# EAGLE schematic Layer 1 (EAGLE 9.6.2)

## Sheet 1 of 5
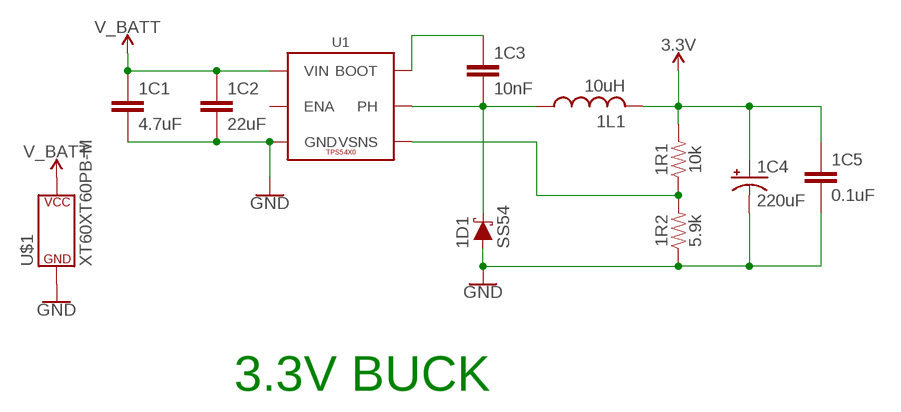
[diagram p0: schematic, sheet 1]

### Parts
1C1  4.7uF  CAPACITOR0603  [C0603]
1C2  22uF  CAPACITOR1210  [C1210]
1C3  10nF  CAPACITOR0603  [C0603]
1C4  220uF  100UF-POLAR-EIA7343-10V-10%(TANT)  [EIA7343]
1C5  0.1uF  CAPACITOR0603  [C0603]
1D1  SS54  DIODE-SCHOTTKY  [SMA-DIODE]
1L1  10uH  INDUCTORSWPA8040  [SWPA8040]
1R1  10k  RESISTOR0603  [R0603]
1R2  5.9k  RESISTOR0603  [R0603]
U1  TPS54X0  [POWERPAD-SOIC-8]
U$1  XT60XT60PB-M  [XT60PB-M]

### Nets
3.3V: 1C4.A(+) 1C5.1 1L1.P2 1R1.2 ; also sheet 2,3,4
GND: 1C1.2 1C2.2 1C4.C(-) 1C5.2 1D1.A 1R2.1 U1.6(GND) U1.9(GND) U1.P$1(GND) U1.P$2(GND) U1.P$3(GND) U1.P$4(GND) U1.P$5(GND) U1.P$6(GND) U$1.-(P$V-) ; also sheet 2,3,4,5
N$1: 1C3.1 U1.1(BOOT)
N$2: 1C3.2 1D1.C 1L1.P1 U1.8(PH)
N$4: 1R1.1 1R2.2 U1.4(VSNS)
V_BATT: 1C1.1 1C2.1 U1.7(VIN) U$1.+(P$V+) ; also sheet 3,4,5
Unconnected: U1.2(NC) U1.3(NC) U1.5(ENA)

### Notes on the sheet
- 3.3V BUCK

## Sheet 2 of 5
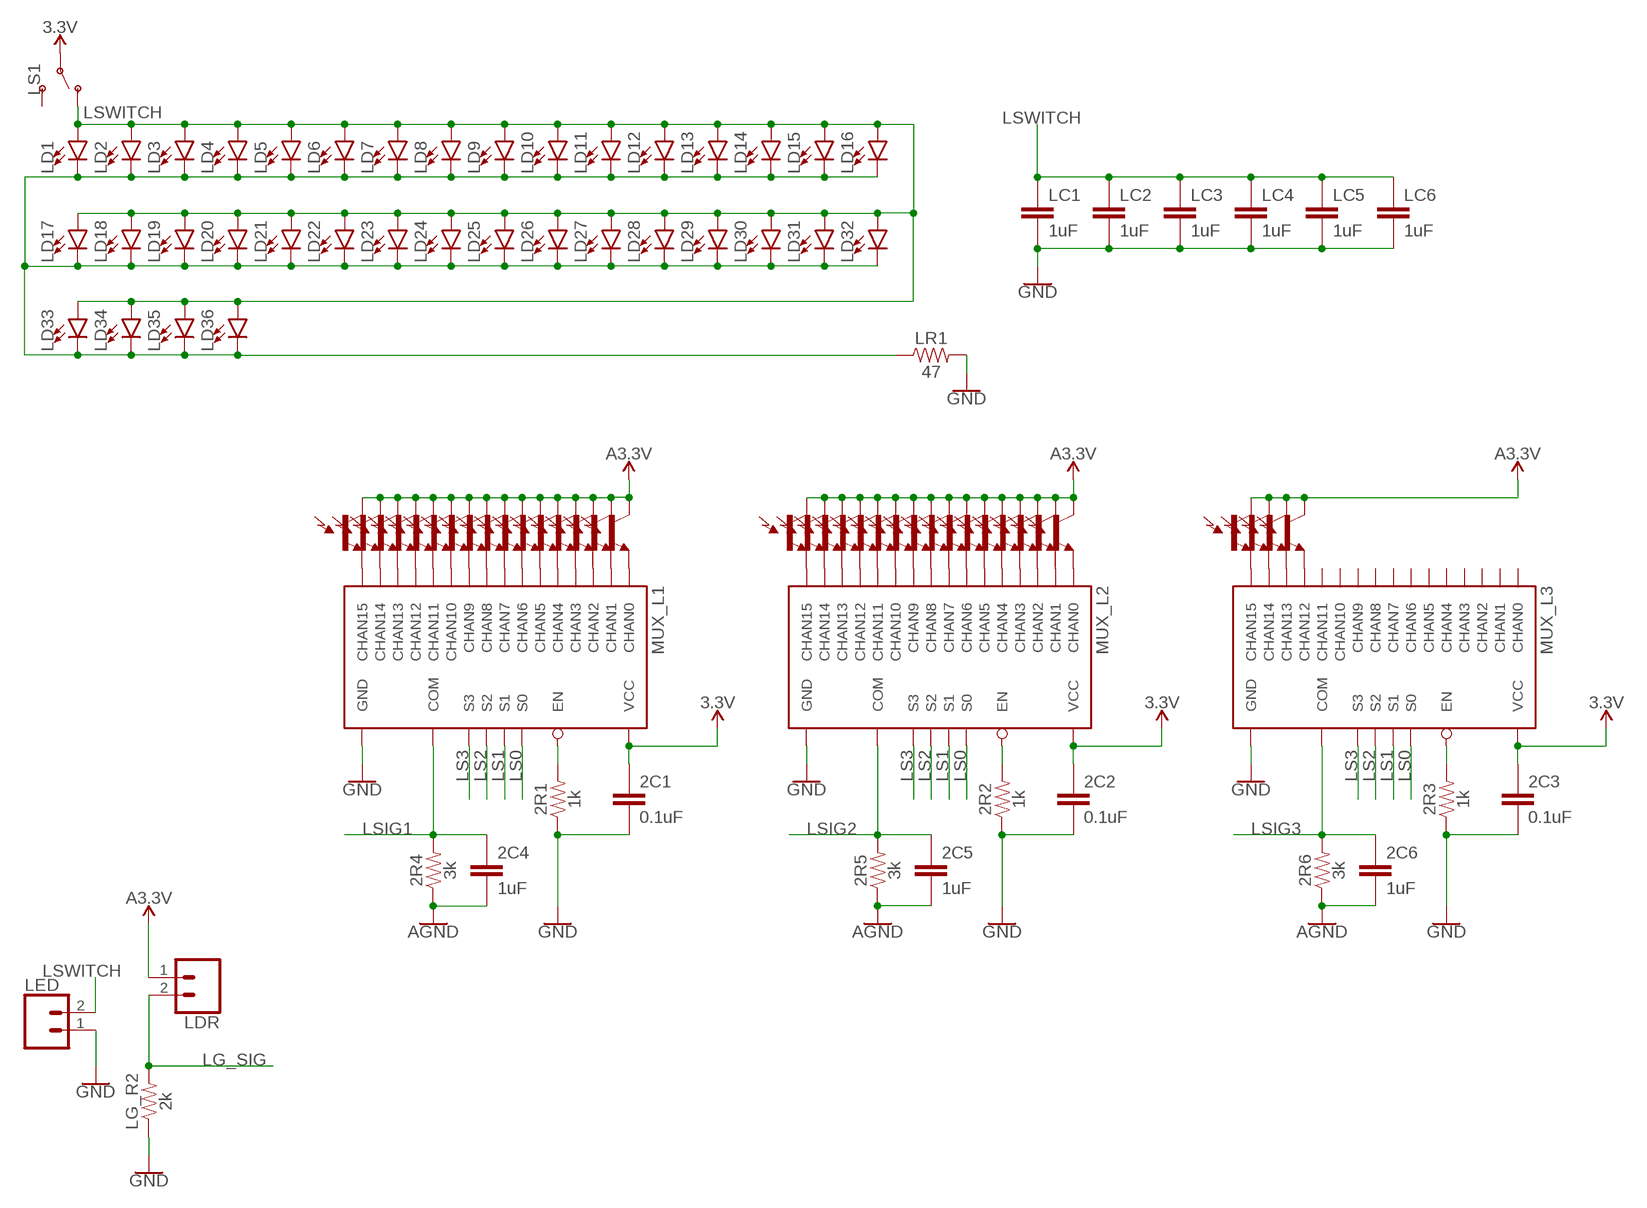
[diagram p1: schematic, sheet 2]

### Parts
2C1  0.1uF  CAPACITOR0603  [C0603]
2C2  0.1uF  CAPACITOR0603  [C0603]
2C3  0.1uF  CAPACITOR0603  [C0603]
2C4  1uF  CAPACITOR0603  [C0603]
2C5  1uF  CAPACITOR0603  [C0603]
2C6  1uF  CAPACITOR0603  [C0603]
2R1  1k  RESISTOR0603  [R0603]
2R2  1k  RESISTOR0603  [R0603]
2R3  1k  RESISTOR0603  [R0603]
2R4  3k  RESISTOR0603  [R0603]
2R5  3k  RESISTOR0603  [R0603]
2R6  3k  RESISTOR0603  [R0603]
LC1  1uF  CAPACITOR0603  [C0603]
LC2  1uF  CAPACITOR0603  [C0603]
LC3  1uF  CAPACITOR0603  [C0603]
LC4  1uF  CAPACITOR0603  [C0603]
LC5  1uF  CAPACITOR0603  [C0603]
LC6  1uF  CAPACITOR0603  [C0603]
LD1  3528LED  [3528]
LD2  3528LED  [3528]
LD3  3528LED  [3528]
LD4  3528LED  [3528]
LD5  3528LED  [3528]
LD6  3528LED  [3528]
LD7  3528LED  [3528]
LD8  3528LED  [3528]
LD9  3528LED  [3528]
LD10  3528LED  [3528]
LD11  3528LED  [3528]
LD12  3528LED  [3528]
LD13  3528LED  [3528]
LD14  3528LED  [3528]
LD15  3528LED  [3528]
LD16  3528LED  [3528]
LD17  3528LED  [3528]
LD18  3528LED  [3528]
LD19  3528LED  [3528]
LD20  3528LED  [3528]
LD21  3528LED  [3528]
LD22  3528LED  [3528]
LD23  3528LED  [3528]
LD24  3528LED  [3528]
LD25  3528LED  [3528]
LD26  3528LED  [3528]
LD27  3528LED  [3528]
LD28  3528LED  [3528]
LD29  3528LED  [3528]
LD30  3528LED  [3528]
LD31  3528LED  [3528]
LD32  3528LED  [3528]
LD33  3528LED  [3528]
LD34  3528LED  [3528]
LD35  3528LED  [3528]
LD36  3528LED  [3528]
LDR  CONN_021X02_NO_SILK  [1X02_NO_SILK]
LED  CONN_02POLAR  [MOLEX-1X2]
LG_R2  2k  RESISTOR0603  [R0603]
LR1  47  RESISTOR0603  [R0603]
LS1  SWITCH-SPDT-PTH-11.6X4.0MM-LOCK  [SWITCH_SPDT_PTH_11.6X4.0MM_LOCK]
MUX_L1  74HC4067SSOP-24  [SSOP24]
MUX_L2  74HC4067SSOP-24  [SSOP24]
MUX_L3  74HC4067SSOP-24  [SSOP24]
Q1  LIGHT_SENSORALS  [ALS-PT19]
Q2  LIGHT_SENSORALS  [ALS-PT19]
Q3  LIGHT_SENSORALS  [ALS-PT19]
Q4  LIGHT_SENSORALS  [ALS-PT19]
Q5  LIGHT_SENSORALS  [ALS-PT19]
Q6  LIGHT_SENSORALS  [ALS-PT19]
Q7  LIGHT_SENSORALS  [ALS-PT19]
Q8  LIGHT_SENSORALS  [ALS-PT19]
Q9  LIGHT_SENSORALS  [ALS-PT19]
Q10  LIGHT_SENSORALS  [ALS-PT19]
Q11  LIGHT_SENSORALS  [ALS-PT19]
Q12  LIGHT_SENSORALS  [ALS-PT19]
Q13  LIGHT_SENSORALS  [ALS-PT19]
Q14  LIGHT_SENSORALS  [ALS-PT19]
Q15  LIGHT_SENSORALS  [ALS-PT19]
Q16  LIGHT_SENSORALS  [ALS-PT19]
Q17  LIGHT_SENSORALS  [ALS-PT19]
Q18  LIGHT_SENSORALS  [ALS-PT19]
Q19  LIGHT_SENSORALS  [ALS-PT19]
Q20  LIGHT_SENSORALS  [ALS-PT19]
Q21  LIGHT_SENSORALS  [ALS-PT19]
Q22  LIGHT_SENSORALS  [ALS-PT19]
Q23  LIGHT_SENSORALS  [ALS-PT19]
Q24  LIGHT_SENSORALS  [ALS-PT19]
Q25  LIGHT_SENSORALS  [ALS-PT19]
Q26  LIGHT_SENSORALS  [ALS-PT19]
Q27  LIGHT_SENSORALS  [ALS-PT19]
Q28  LIGHT_SENSORALS  [ALS-PT19]
Q29  LIGHT_SENSORALS  [ALS-PT19]
Q30  LIGHT_SENSORALS  [ALS-PT19]
Q31  LIGHT_SENSORALS  [ALS-PT19]
Q32  LIGHT_SENSORALS  [ALS-PT19]
Q33  LIGHT_SENSORALS  [ALS-PT19]
Q34  LIGHT_SENSORALS  [ALS-PT19]
Q35  LIGHT_SENSORALS  [ALS-PT19]
Q36  LIGHT_SENSORALS  [ALS-PT19]

### Nets
3.3V: 2C1.1 2C2.1 2C3.1 LS1.2(P) MUX_L1.24(VCC) MUX_L2.24(VCC) MUX_L3.24(VCC) ; also sheet 1,3,4
AGND: 2C4.2 2C5.2 2C6.2 2R4.1 2R5.1 2R6.1 ; also sheet 4
GND: 2C1.2 2C2.2 2C3.2 2R1.1 2R2.1 2R3.1 LC1.2 LC2.2 LC3.2 LC4.2 LC5.2 LC6.2 LED.1 LG_R2.1 LR1.2 MUX_L1.12(GND) MUX_L2.12(GND) MUX_L3.12(GND) ; also sheet 1,3,4,5
LG_SIG: LDR.2 LG_R2.2 ; also sheet 4
LS0: MUX_L1.10(S0) MUX_L2.10(S0) MUX_L3.10(S0) ; also sheet 4
LS1: MUX_L1.11(S1) MUX_L2.11(S1) MUX_L3.11(S1) ; also sheet 4
LS2: MUX_L1.14(S2) MUX_L2.14(S2) MUX_L3.14(S2) ; also sheet 4
LS3: MUX_L1.13(S3) MUX_L2.13(S3) MUX_L3.13(S3) ; also sheet 4
LSIG1: 2C4.1 2R4.2 MUX_L1.1(COM) ; also sheet 4
LSIG2: 2C5.1 2R5.2 MUX_L2.1(COM) ; also sheet 4
LSIG3: 2C6.1 2R6.2 MUX_L3.1(COM) ; also sheet 4
LSWITCH: LC1.1 LC2.1 LC3.1 LC4.1 LC5.1 LC6.1 LD1.A LD2.A LD3.A LD4.A LD5.A LD6.A LD7.A LD8.A LD9.A LD10.A LD11.A LD12.A LD13.A LD14.A LD15.A LD16.A LD17.A LD18.A LD19.A LD20.A LD21.A LD22.A LD23.A LD24.A LD25.A LD26.A LD27.A LD28.A LD29.A LD30.A LD31.A LD32.A LD33.A LD34.A LD35.A LD36.A LED.2 LS1.1(O)
N$52: 2R1.2 MUX_L1.15(EN)
N$53: MUX_L1.16(CHAN15) Q1.E(E1)
N$54: MUX_L1.17(CHAN14) Q2.E(E1)
N$55: MUX_L1.18(CHAN13) Q3.E(E1)
N$56: MUX_L1.19(CHAN12) Q4.E(E1)
N$57: MUX_L1.20(CHAN11) Q5.E(E1)
N$58: MUX_L1.21(CHAN10) Q6.E(E1)
N$59: MUX_L1.22(CHAN9) Q7.E(E1)
N$60: MUX_L1.23(CHAN8) Q8.E(E1)
N$61: MUX_L1.2(CHAN7) Q9.E(E1)
N$62: MUX_L1.3(CHAN6) Q10.E(E1)
N$63: MUX_L1.4(CHAN5) Q11.E(E1)
N$64: MUX_L1.5(CHAN4) Q12.E(E1)
N$65: MUX_L1.6(CHAN3) Q13.E(E1)
N$66: MUX_L1.7(CHAN2) Q14.E(E1)
N$67: MUX_L1.8(CHAN1) Q15.E(E1)
N$68: MUX_L1.9(CHAN0) Q16.E(E1)
N$69: LD1.C LD2.C LD3.C LD4.C LD5.C LD6.C LD7.C LD8.C LD9.C LD10.C LD11.C LD12.C LD13.C LD14.C LD15.C LD16.C LD17.C LD18.C LD19.C LD20.C LD21.C LD22.C LD23.C LD24.C LD25.C LD26.C LD27.C LD28.C LD29.C LD30.C LD31.C LD32.C LD33.C LD34.C LD35.C LD36.C LR1.1
N$82: 2R2.2 MUX_L2.15(EN)
N$83: MUX_L2.16(CHAN15) Q17.E(E1)
N$84: MUX_L2.17(CHAN14) Q18.E(E1)
N$85: MUX_L2.18(CHAN13) Q19.E(E1)
N$86: MUX_L2.19(CHAN12) Q20.E(E1)
N$87: MUX_L2.20(CHAN11) Q21.E(E1)
N$88: MUX_L2.21(CHAN10) Q22.E(E1)
N$89: MUX_L2.22(CHAN9) Q23.E(E1)
N$90: MUX_L2.23(CHAN8) Q24.E(E1)
N$91: MUX_L2.2(CHAN7) Q25.E(E1)
N$92: MUX_L2.3(CHAN6) Q26.E(E1)
N$93: MUX_L2.4(CHAN5) Q27.E(E1)
N$94: MUX_L2.5(CHAN4) Q28.E(E1)
N$95: MUX_L2.6(CHAN3) Q29.E(E1)
N$96: MUX_L2.7(CHAN2) Q30.E(E1)
N$97: MUX_L2.8(CHAN1) Q31.E(E1)
N$98: MUX_L2.9(CHAN0) Q32.E(E1)
N$99: 2R3.2 MUX_L3.15(EN)
N$100: MUX_L3.16(CHAN15) Q33.E(E1)
N$101: MUX_L3.17(CHAN14) Q34.E(E1)
N$102: MUX_L3.18(CHAN13) Q35.E(E1)
N$103: MUX_L3.19(CHAN12) Q36.E(E1)
VCCA: LDR.1 Q1.C(C1) Q2.C(C1) Q3.C(C1) Q4.C(C1) Q5.C(C1) Q6.C(C1) Q7.C(C1) Q8.C(C1) Q9.C(C1) Q10.C(C1) Q11.C(C1) Q12.C(C1) Q13.C(C1) Q14.C(C1) Q15.C(C1) Q16.C(C1) Q17.C(C1) Q18.C(C1) Q19.C(C1) Q20.C(C1) Q21.C(C1) Q22.C(C1) Q23.C(C1) Q24.C(C1) Q25.C(C1) Q26.C(C1) Q27.C(C1) Q28.C(C1) Q29.C(C1) Q30.C(C1) Q31.C(C1) Q32.C(C1) Q33.C(C1) Q34.C(C1) Q35.C(C1) Q36.C(C1) ; supply symbol labelled A3.3V ; also sheet 4
Unconnected: LS1.3(S) MUX_L3.2(CHAN7) MUX_L3.3(CHAN6) MUX_L3.4(CHAN5) MUX_L3.5(CHAN4) MUX_L3.6(CHAN3) MUX_L3.7(CHAN2) MUX_L3.8(CHAN1) MUX_L3.9(CHAN0) MUX_L3.20(CHAN11) MUX_L3.21(CHAN10) MUX_L3.22(CHAN9) MUX_L3.23(CHAN8)

## Sheet 3 of 5
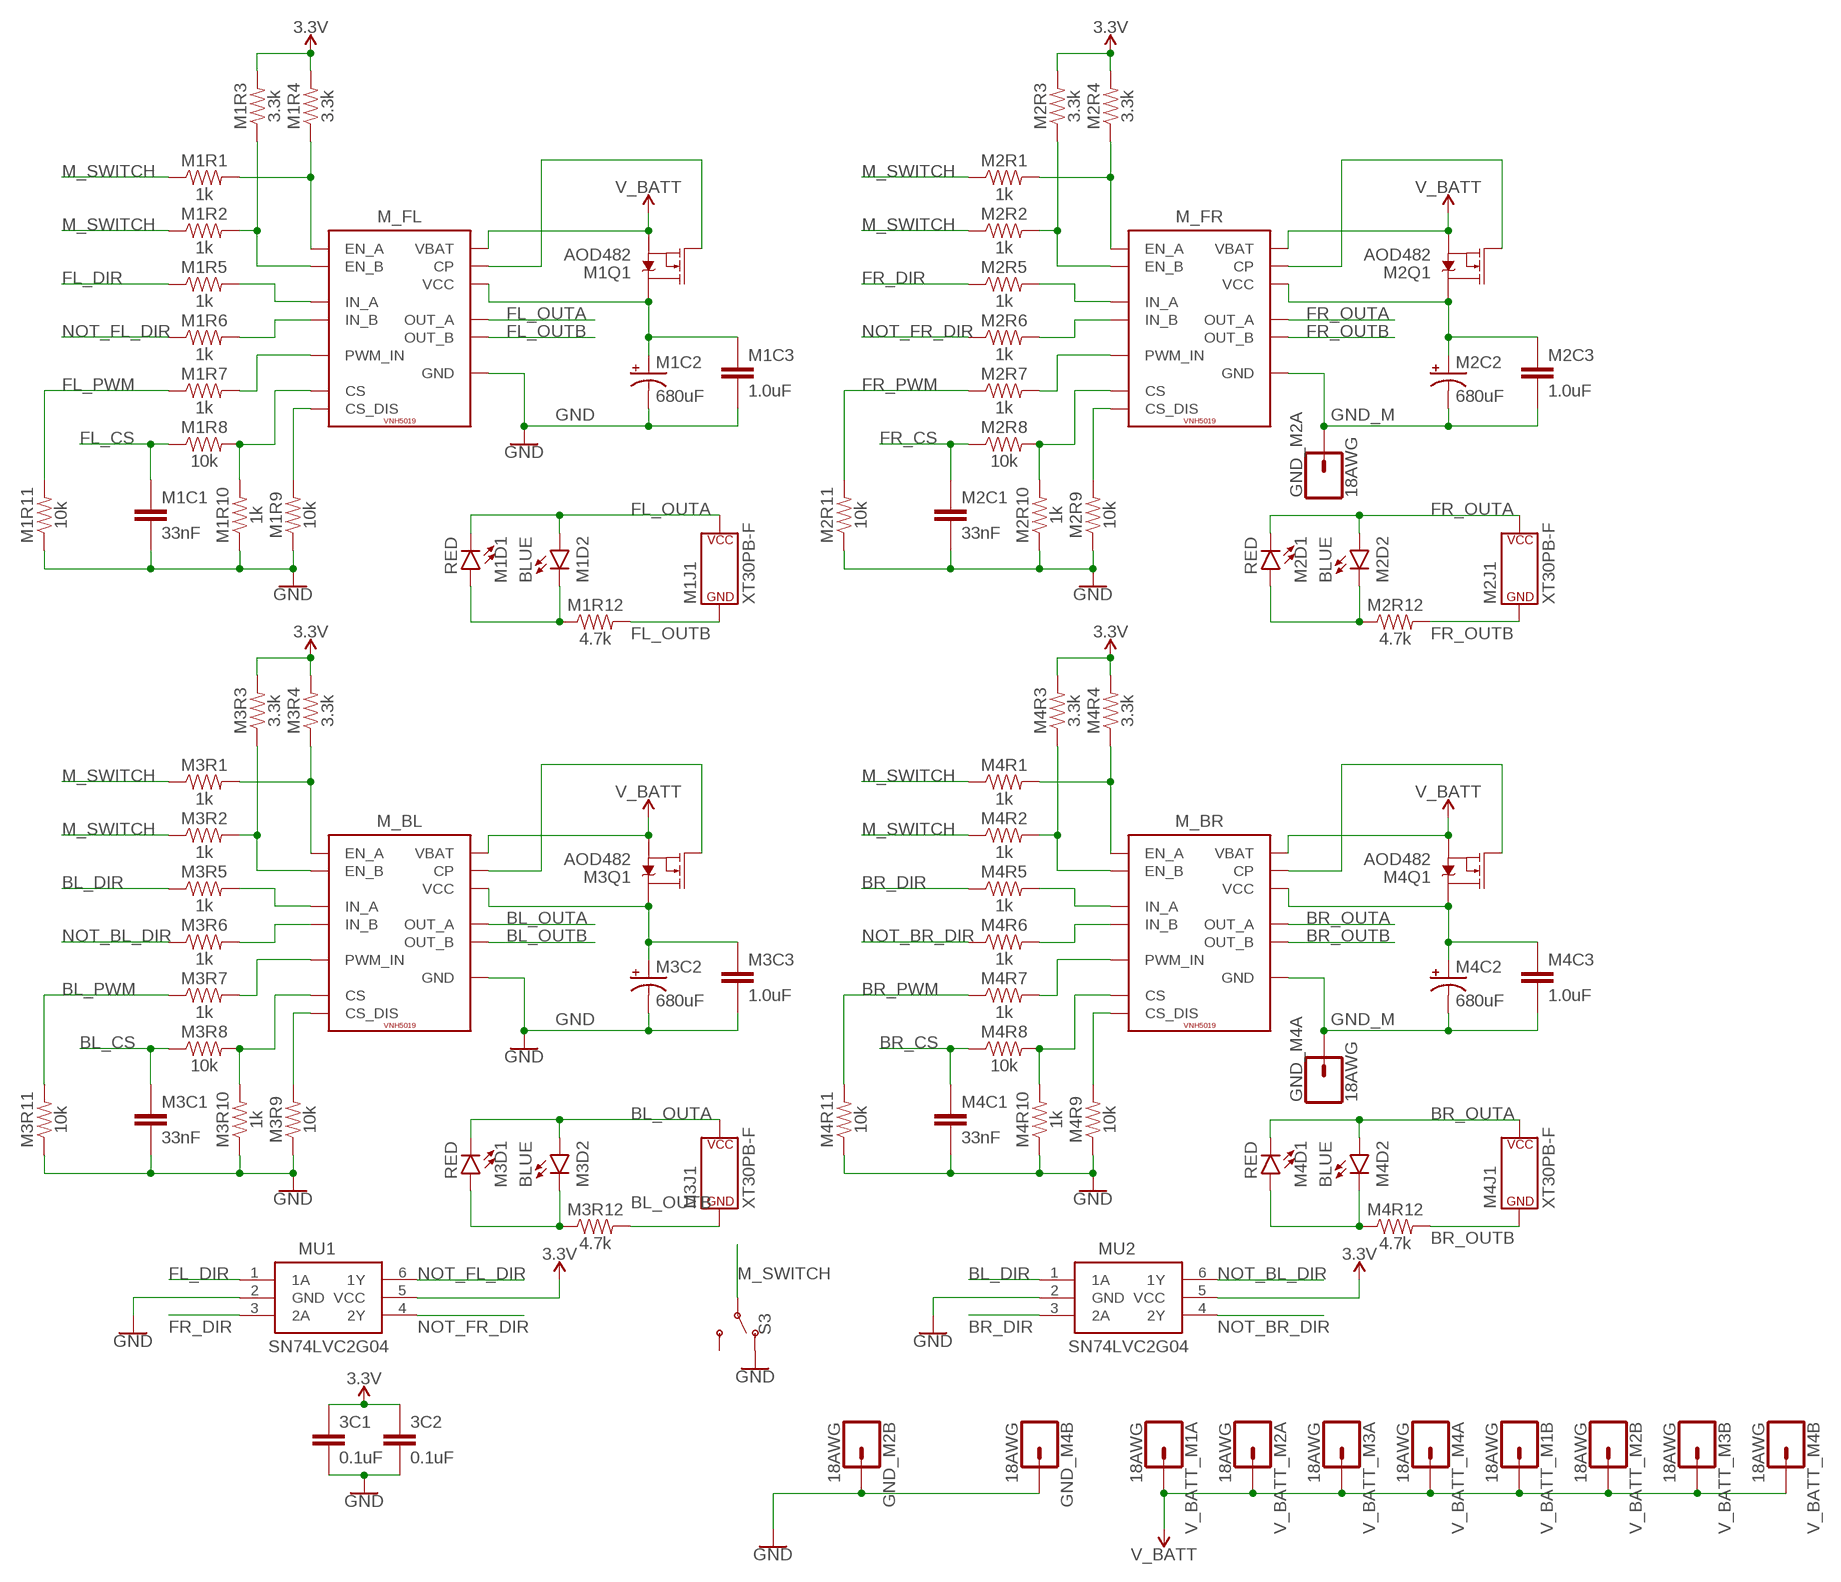
[diagram p2: schematic, sheet 3]

### Parts
3C1  0.1uF  CAPACITOR0603  [C0603]
3C2  0.1uF  CAPACITOR0603  [C0603]
GND_M2A  18AWG  [18AWG]
GND_M2B  18AWG  [18AWG]
GND_M4A  18AWG  [18AWG]
GND_M4B  18AWG  [18AWG]
M1C1  33nF  CAPACITOR0603  [C0603]
M1C2  680uF  3.5MM_CAP  [3.5MM_CAP]
M1C3  1.0uF  CAPACITOR0603  [C0603]
M1D1  RED  LED-RED0603  [LED-0603]
M1D2  BLUE  LED-BLUE0603  [LED-0603]
M1J1  XT30PB-F  [XT30PB-F]
M1Q1  AOD482  MOSFET-NCH-FDD8780  [DPAK]
M1R1  1k  RESISTOR0603  [R0603]
M1R2  1k  RESISTOR0603  [R0603]
M1R3  3.3k  RESISTOR0603  [R0603]
M1R4  3.3k  RESISTOR0603  [R0603]
M1R5  1k  RESISTOR0603  [R0603]
M1R6  1k  RESISTOR0603  [R0603]
M1R7  1k  RESISTOR0603  [R0603]
M1R8  10k  RESISTOR0603  [R0603]
M1R9  10k  RESISTOR0603  [R0603]
M1R10  1k  RESISTOR0603  [R0603]
M1R11  10k  RESISTOR0603  [R0603]
M1R12  4.7k  RESISTOR0603  [R0603]
M2C1  33nF  CAPACITOR0603  [C0603]
M2C2  680uF  3.5MM_CAP  [3.5MM_CAP]
M2C3  1.0uF  CAPACITOR0603  [C0603]
M2D1  RED  LED-RED0603  [LED-0603]
M2D2  BLUE  LED-BLUE0603  [LED-0603]
M2J1  XT30PB-F  [XT30PB-F]
M2Q1  AOD482  MOSFET-NCH-FDD8780  [DPAK]
M2R1  1k  RESISTOR0603  [R0603]
M2R2  1k  RESISTOR0603  [R0603]
M2R3  3.3k  RESISTOR0603  [R0603]
M2R4  3.3k  RESISTOR0603  [R0603]
M2R5  1k  RESISTOR0603  [R0603]
M2R6  1k  RESISTOR0603  [R0603]
M2R7  1k  RESISTOR0603  [R0603]
M2R8  10k  RESISTOR0603  [R0603]
M2R9  10k  RESISTOR0603  [R0603]
M2R10  1k  RESISTOR0603  [R0603]
M2R11  10k  RESISTOR0603  [R0603]
M2R12  4.7k  RESISTOR0603  [R0603]
M3C1  33nF  CAPACITOR0603  [C0603]
M3C2  680uF  3.5MM_CAP  [3.5MM_CAP]
M3C3  1.0uF  CAPACITOR0603  [C0603]
M3D1  RED  LED-RED0603  [LED-0603]
M3D2  BLUE  LED-BLUE0603  [LED-0603]
M3J1  XT30PB-F  [XT30PB-F]
M3Q1  AOD482  MOSFET-NCH-FDD8780  [DPAK]
M3R1  1k  RESISTOR0603  [R0603]
M3R2  1k  RESISTOR0603  [R0603]
M3R3  3.3k  RESISTOR0603  [R0603]
M3R4  3.3k  RESISTOR0603  [R0603]
M3R5  1k  RESISTOR0603  [R0603]
M3R6  1k  RESISTOR0603  [R0603]
M3R7  1k  RESISTOR0603  [R0603]
M3R8  10k  RESISTOR0603  [R0603]
M3R9  10k  RESISTOR0603  [R0603]
M3R10  1k  RESISTOR0603  [R0603]
M3R11  10k  RESISTOR0603  [R0603]
M3R12  4.7k  RESISTOR0603  [R0603]
M4C1  33nF  CAPACITOR0603  [C0603]
M4C2  680uF  3.5MM_CAP  [3.5MM_CAP]
M4C3  1.0uF  CAPACITOR0603  [C0603]
M4D1  RED  LED-RED0603  [LED-0603]
M4D2  BLUE  LED-BLUE0603  [LED-0603]
M4J1  XT30PB-F  [XT30PB-F]
M4Q1  AOD482  MOSFET-NCH-FDD8780  [DPAK]
M4R1  1k  RESISTOR0603  [R0603]
M4R2  1k  RESISTOR0603  [R0603]
M4R3  3.3k  RESISTOR0603  [R0603]
M4R4  3.3k  RESISTOR0603  [R0603]
M4R5  1k  RESISTOR0603  [R0603]
M4R6  1k  RESISTOR0603  [R0603]
M4R7  1k  RESISTOR0603  [R0603]
M4R8  10k  RESISTOR0603  [R0603]
M4R9  10k  RESISTOR0603  [R0603]
M4R10  1k  RESISTOR0603  [R0603]
M4R11  10k  RESISTOR0603  [R0603]
M4R12  4.7k  RESISTOR0603  [R0603]
M_BL  VNH5019  [POWERSO-30]
M_BR  VNH5019  [POWERSO-30]
M_FL  VNH5019  [POWERSO-30]
M_FR  VNH5019  [POWERSO-30]
MU1  SN74LVC2G04DBVR  [SOT23-6]
MU2  SN74LVC2G04DBVR  [SOT23-6]
S3  SWITCH-SPDT-PTH-11.6X4.0MM-LOCK  [SWITCH_SPDT_PTH_11.6X4.0MM_LOCK]
V_BATT_M1A  18AWG  [18AWG]
V_BATT_M1B  18AWG  [18AWG]
V_BATT_M2A  18AWG  [18AWG]
V_BATT_M2B  18AWG  [18AWG]
V_BATT_M3A  18AWG  [18AWG]
V_BATT_M3B  18AWG  [18AWG]
V_BATT_M4A  18AWG  [18AWG]
V_BATT_M4B  18AWG  [18AWG]

### Nets
3.3V: 3C1.1 3C2.1 M1R3.2 M1R4.2 M2R3.2 M2R4.2 M3R3.2 M3R4.2 M4R3.2 M4R4.2 MU1.5(VCC) MU2.5(VCC) ; also sheet 1,2,4
BL_CS: M3C1.1 M3R8.1 ; also sheet 4
BL_DIR: M3R5.1 MU2.1(1A) ; also sheet 4
BL_OUTA: M3D1.C M3D2.A M3J1.+(P$V+) M_BL.P1(OUT_A) M_BL.P25(OUT_A) M_BL.P30(OUT_A) M_BL.P$1(OUT_A) M_BL.P$2(OUT_A) M_BL.P$3(OUT_A) M_BL.P$4(OUT_A) M_BL.P$5(OUT_A) M_BL.P$6(OUT_A) M_BL.P$7(OUT_A) M_BL.P$8(OUT_A) M_BL.P$9(OUT_A) M_BL.SLUG2(OUT_A)
BL_OUTB: M3J1.-(P$V-) M3R12.2 M_BL.P15(OUT_B) M_BL.P16(OUT_B) M_BL.P21(OUT_B) M_BL.P$10(OUT_B) M_BL.P$11(OUT_B) M_BL.P$12(OUT_B) M_BL.P$13(OUT_B) M_BL.P$14(OUT_B) M_BL.P$15(OUT_B) M_BL.P$16(OUT_B) M_BL.P$17(OUT_B) M_BL.P$18(OUT_B) M_BL.SLUG3(OUT_B)
BL_PWM: M3R7.1 M3R11.2 ; also sheet 4
BR_CS: M4C1.1 M4R8.1 ; also sheet 4
BR_DIR: M4R5.1 MU2.3(2A) ; also sheet 4
BR_OUTA: M4D1.C M4D2.A M4J1.+(P$V+) M_BR.P1(OUT_A) M_BR.P25(OUT_A) M_BR.P30(OUT_A) M_BR.P$1(OUT_A) M_BR.P$2(OUT_A) M_BR.P$3(OUT_A) M_BR.P$4(OUT_A) M_BR.P$5(OUT_A) M_BR.P$6(OUT_A) M_BR.P$7(OUT_A) M_BR.P$8(OUT_A) M_BR.P$9(OUT_A) M_BR.SLUG2(OUT_A)
BR_OUTB: M4J1.-(P$V-) M4R12.2 M_BR.P15(OUT_B) M_BR.P16(OUT_B) M_BR.P21(OUT_B) M_BR.P$10(OUT_B) M_BR.P$11(OUT_B) M_BR.P$12(OUT_B) M_BR.P$13(OUT_B) M_BR.P$14(OUT_B) M_BR.P$15(OUT_B) M_BR.P$16(OUT_B) M_BR.P$17(OUT_B) M_BR.P$18(OUT_B) M_BR.SLUG3(OUT_B)
BR_PWM: M4R7.1 M4R11.2 ; also sheet 4
FL_CS: M1C1.1 M1R8.1 ; also sheet 4
FL_DIR: M1R5.1 MU1.1(1A) ; also sheet 4
FL_OUTA: M1D1.C M1D2.A M1J1.+(P$V+) M_FL.P1(OUT_A) M_FL.P25(OUT_A) M_FL.P30(OUT_A) M_FL.P$1(OUT_A) M_FL.P$2(OUT_A) M_FL.P$3(OUT_A) M_FL.P$4(OUT_A) M_FL.P$5(OUT_A) M_FL.P$6(OUT_A) M_FL.P$7(OUT_A) M_FL.P$8(OUT_A) M_FL.P$9(OUT_A) M_FL.SLUG2(OUT_A)
FL_OUTB: M1J1.-(P$V-) M1R12.2 M_FL.P15(OUT_B) M_FL.P16(OUT_B) M_FL.P21(OUT_B) M_FL.P$10(OUT_B) M_FL.P$11(OUT_B) M_FL.P$12(OUT_B) M_FL.P$13(OUT_B) M_FL.P$14(OUT_B) M_FL.P$15(OUT_B) M_FL.P$16(OUT_B) M_FL.P$17(OUT_B) M_FL.P$18(OUT_B) M_FL.SLUG3(OUT_B)
FL_PWM: M1R7.1 M1R11.2 ; also sheet 4
FR_CS: M2C1.1 M2R8.1 ; also sheet 4
FR_DIR: M2R5.1 MU1.3(2A) ; also sheet 4
FR_OUTA: M2D1.C M2D2.A M2J1.+(P$V+) M_FR.P1(OUT_A) M_FR.P25(OUT_A) M_FR.P30(OUT_A) M_FR.P$1(OUT_A) M_FR.P$2(OUT_A) M_FR.P$3(OUT_A) M_FR.P$4(OUT_A) M_FR.P$5(OUT_A) M_FR.P$6(OUT_A) M_FR.P$7(OUT_A) M_FR.P$8(OUT_A) M_FR.P$9(OUT_A) M_FR.SLUG2(OUT_A)
FR_OUTB: M2J1.-(P$V-) M2R12.2 M_FR.P15(OUT_B) M_FR.P16(OUT_B) M_FR.P21(OUT_B) M_FR.P$10(OUT_B) M_FR.P$11(OUT_B) M_FR.P$12(OUT_B) M_FR.P$13(OUT_B) M_FR.P$14(OUT_B) M_FR.P$15(OUT_B) M_FR.P$16(OUT_B) M_FR.P$17(OUT_B) M_FR.P$18(OUT_B) M_FR.SLUG3(OUT_B)
FR_PWM: M2R7.1 M2R11.2 ; also sheet 4
GND: 3C1.2 3C2.2 GND_M2B.P$1 GND_M4B.P$1 M1C1.2 M1C2.2(-) M1C3.2 M1R9.1 M1R10.1 M1R11.1 M2C1.2 M2R9.1 M2R10.1 M2R11.1 M3C1.2 M3C2.2(-) M3C3.2 M3R9.1 M3R10.1 M3R11.1 M4C1.2 M4R9.1 M4R10.1 M4R11.1 M_BL.P18(GND) M_BL.P19(GND) M_BL.P20(GND) M_BL.P26(GND) M_BL.P27(GND) M_BL.P28(GND) M_FL.P18(GND) M_FL.P19(GND) M_FL.P20(GND) M_FL.P26(GND) M_FL.P27(GND) M_FL.P28(GND) MU1.2(GND) MU2.2(GND) S3.1(O) ; also sheet 1,2,4,5
GND_M: GND_M2A.P$1 GND_M4A.P$1 M2C2.2(-) M2C3.2 M4C2.2(-) M4C3.2 M_BR.P18(GND) M_BR.P19(GND) M_BR.P20(GND) M_BR.P26(GND) M_BR.P27(GND) M_BR.P28(GND) M_FR.P18(GND) M_FR.P19(GND) M_FR.P20(GND) M_FR.P26(GND) M_FR.P27(GND) M_FR.P28(GND)
M_SWITCH: M1R1.1 M1R2.1 M2R1.1 M2R2.1 M3R1.1 M3R2.1 M4R1.1 M4R2.1 S3.2(P)
N$11: M1R1.2 M1R4.1 M_FL.P5(EN_A)
N$12: M1R2.2 M1R3.1 M_FL.P9(EN_B)
N$13: M1R5.2 M_FL.P4(IN_A)
N$14: M1R6.2 M_FL.P10(IN_B)
N$15: M1R7.2 M_FL.P7(PWM_IN)
N$16: M1R8.2 M1R10.2 M_FL.P8(CS)
N$17: M1R9.2 M_FL.P6(CS_DIS)
N$18: M1C2.1(+) M1C3.1 M1Q1.4(D) M_FL.P3(VCC) M_FL.P13(VCC) M_FL.P23(VCC) M_FL.P$19(VCC) M_FL.P$20(VCC) M_FL.P$21(VCC) M_FL.P$22(VCC) M_FL.P$23(VCC) M_FL.P$24(VCC) M_FL.P$25(VCC) M_FL.P$26(VCC) M_FL.P$27(VCC) M_FL.P$28(VCC) M_FL.SLUG1(VCC)
N$19: M1Q1.1(G) M_FL.P11(CP)
N$20: M2R2.2 M2R3.1 M_FR.P9(EN_B)
N$21: M1D1.A M1D2.C M1R12.1
N$22: M2R1.2 M2R4.1 M_FR.P5(EN_A)
N$23: M2R6.2 M_FR.P10(IN_B)
N$24: M2R5.2 M_FR.P4(IN_A)
N$25: M2R7.2 M_FR.P7(PWM_IN)
N$26: M2R8.2 M2R10.2 M_FR.P8(CS)
N$27: M2R9.2 M_FR.P6(CS_DIS)
N$28: M2C2.1(+) M2C3.1 M2Q1.4(D) M_FR.P3(VCC) M_FR.P13(VCC) M_FR.P23(VCC) M_FR.P$19(VCC) M_FR.P$20(VCC) M_FR.P$21(VCC) M_FR.P$22(VCC) M_FR.P$23(VCC) M_FR.P$24(VCC) M_FR.P$25(VCC) M_FR.P$26(VCC) M_FR.P$27(VCC) M_FR.P$28(VCC) M_FR.SLUG1(VCC)
N$29: M2Q1.1(G) M_FR.P11(CP)
N$30: M3R2.2 M3R3.1 M_BL.P9(EN_B)
N$31: M2D1.A M2D2.C M2R12.1
N$32: M3R1.2 M3R4.1 M_BL.P5(EN_A)
N$33: M3R6.2 M_BL.P10(IN_B)
N$34: M3R5.2 M_BL.P4(IN_A)
N$35: M3R7.2 M_BL.P7(PWM_IN)
N$36: M3R8.2 M3R10.2 M_BL.P8(CS)
N$37: M3R9.2 M_BL.P6(CS_DIS)
N$38: M3C2.1(+) M3C3.1 M3Q1.4(D) M_BL.P3(VCC) M_BL.P13(VCC) M_BL.P23(VCC) M_BL.P$19(VCC) M_BL.P$20(VCC) M_BL.P$21(VCC) M_BL.P$22(VCC) M_BL.P$23(VCC) M_BL.P$24(VCC) M_BL.P$25(VCC) M_BL.P$26(VCC) M_BL.P$27(VCC) M_BL.P$28(VCC) M_BL.SLUG1(VCC)
N$39: M3Q1.1(G) M_BL.P11(CP)
N$40: M4R2.2 M4R3.1 M_BR.P9(EN_B)
N$41: M4R1.2 M4R4.1 M_BR.P5(EN_A)
N$42: M4R6.2 M_BR.P10(IN_B)
N$43: M4R5.2 M_BR.P4(IN_A)
N$44: M4R7.2 M_BR.P7(PWM_IN)
N$45: M3D1.A M3D2.C M3R12.1
N$46: M4R8.2 M4R10.2 M_BR.P8(CS)
N$47: M4R9.2 M_BR.P6(CS_DIS)
N$48: M4C2.1(+) M4C3.1 M4Q1.4(D) M_BR.P3(VCC) M_BR.P13(VCC) M_BR.P23(VCC) M_BR.P$19(VCC) M_BR.P$20(VCC) M_BR.P$21(VCC) M_BR.P$22(VCC) M_BR.P$23(VCC) M_BR.P$24(VCC) M_BR.P$25(VCC) M_BR.P$26(VCC) M_BR.P$27(VCC) M_BR.P$28(VCC) M_BR.SLUG1(VCC)
N$49: M4Q1.1(G) M_BR.P11(CP)
N$50: M4D1.A M4D2.C M4R12.1
NOT_BL_DIR: M3R6.1 MU2.6(1Y)
NOT_BR_DIR: M4R6.1 MU2.4(2Y)
NOT_FL_DIR: M1R6.1 MU1.6(1Y)
NOT_FR_DIR: M2R6.1 MU1.4(2Y)
V_BATT: M1Q1.3(S) M2Q1.3(S) M3Q1.3(S) M4Q1.3(S) M_BL.P12(VBAT) M_BR.P12(VBAT) M_FL.P12(VBAT) M_FR.P12(VBAT) V_BATT_M1A.P$1 V_BATT_M1B.P$1 V_BATT_M2A.P$1 V_BATT_M2B.P$1 V_BATT_M3A.P$1 V_BATT_M3B.P$1 V_BATT_M4A.P$1 V_BATT_M4B.P$1 ; also sheet 1,4,5
Unconnected: M_BL.P2(NC) M_BL.P14(NC) M_BL.P17(NC) M_BL.P22(NC) M_BL.P24(NC) M_BL.P29(NC) M_BR.P2(NC) M_BR.P14(NC) M_BR.P17(NC) M_BR.P22(NC) M_BR.P24(NC) M_BR.P29(NC) M_FL.P2(NC) M_FL.P14(NC) M_FL.P17(NC) M_FL.P22(NC) M_FL.P24(NC) M_FL.P29(NC) M_FR.P2(NC) M_FR.P14(NC) M_FR.P17(NC) M_FR.P22(NC) M_FR.P24(NC) M_FR.P29(NC) S3.3(S)

## Sheet 4 of 5
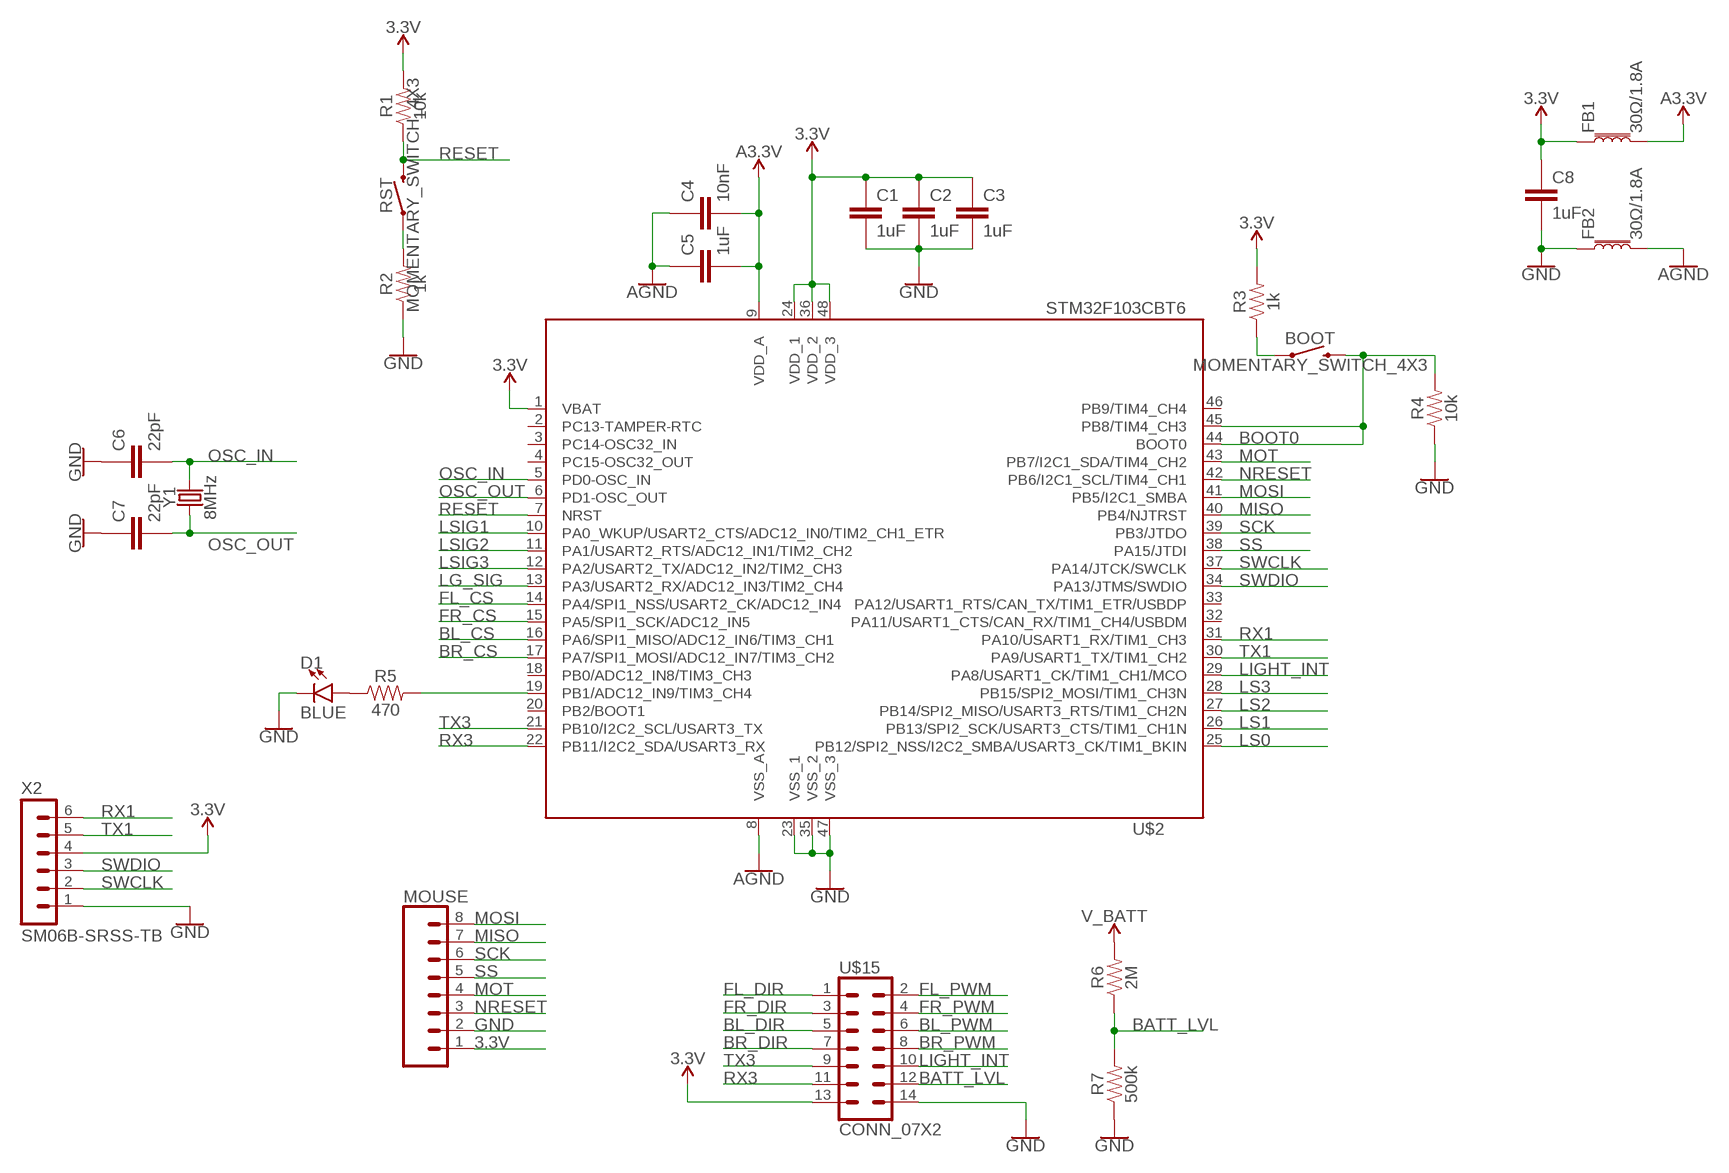
[diagram p3: schematic, sheet 4]

### Parts
BOOT  MOMENTARY_SWITCH_4X3  [MOMENTARY_SWITCH_4X3]
C1  1uF  CAPACITOR0603  [C0603]
C2  1uF  CAPACITOR0603  [C0603]
C3  1uF  CAPACITOR0603  [C0603]
C4  10nF  CAPACITOR0603  [C0603]
C5  1uF  CAPACITOR0603  [C0603]
C6  22pF  CAPACITOR0603  [C0603]
C7  22pF  CAPACITOR0603  [C0603]
C8  1uF  CAPACITOR0603  [C0603]
D1  BLUE  LED0603  [LED-0603]
FB1  30Ω/1.8A  FERRITE_BEAD-0603  [0603]
FB2  30Ω/1.8A  FERRITE_BEAD-0603  [0603]
MOUSE  CONN_08LOCK  [1X08_LOCK]
R1  10k  RESISTOR0603  [R0603]
R2  1k  RESISTOR0603  [R0603]
R3  1k  RESISTOR0603  [R0603]
R4  10k  RESISTOR0603  [R0603]
R5  470  RESISTOR0603  [R0603]
R6  2M  RESISTOR0603  [R0603]
R7  500k  RESISTOR0603  [R0603]
RST  MOMENTARY_SWITCH_4X3  [MOMENTARY_SWITCH_4X3]
U$2  STM32F103CBT6  [LQFP48]
U$15  CONN_07X2  [2X7]
X2  SM06B-SRSS-TB  [SM06B-SRSS-TB]
Y1  8MHz  CRYSTALSMD-5X3.2-2PAD  [CRYSTAL-SMD-5X3.2-2PAD]

### Nets
3.3V: C1.1 C2.1 C3.1 C8.1 FB1.1 MOUSE.1 R1.2 R3.2 U$2.1(VBAT) U$2.24(VDD_1) U$2.36(VDD_2) U$2.48(VDD_3) U$15.13 X2.4 ; also sheet 1,2,3
AGND: C4.1 C5.1 FB2.2 U$2.8(VSS_A) ; also sheet 2
BATT_LVL: R6.1 R7.2 U$15.12
BL_CS: U$2.16(PA6/SPI1_MISO/ADC12_IN6/TIM3_CH1) ; also sheet 3
BL_DIR: U$15.5 ; also sheet 3
BL_PWM: U$15.6 ; also sheet 3
BOOT0: BOOT.P$2 R4.2 U$2.44(BOOT0) U$2.45(PB8/TIM4_CH3)
BR_CS: U$2.17(PA7/SPI1_MOSI/ADC12_IN7/TIM3_CH2) ; also sheet 3
BR_DIR: U$15.7 ; also sheet 3
BR_PWM: U$15.8 ; also sheet 3
FL_CS: U$2.14(PA4/SPI1_NSS/USART2_CK/ADC12_IN4) ; also sheet 3
FL_DIR: U$15.1 ; also sheet 3
FL_PWM: U$15.2 ; also sheet 3
FR_CS: U$2.15(PA5/SPI1_SCK/ADC12_IN5) ; also sheet 3
FR_DIR: U$15.3 ; also sheet 3
FR_PWM: U$15.4 ; also sheet 3
GND: C1.2 C2.2 C3.2 C6.1 C7.1 C8.2 D1.C FB2.1 MOUSE.2 R2.1 R4.1 R7.1 U$2.23(VSS_1) U$2.35(VSS_2) U$2.47(VSS_3) U$15.14 X2.1 ; also sheet 1,2,3,5
LG_SIG: U$2.13(PA3/USART2_RX/ADC12_IN3/TIM2_CH4) ; also sheet 2
LIGHT_INT: U$2.29(PA8/USART1_CK/TIM1_CH1/MCO) U$15.10
LS0: U$2.25(PB12/SPI2_NSS/I2C2_SMBA/USART3_CK/TIM1_BKIN) ; also sheet 2
LS1: U$2.26(PB13/SPI2_SCK/USART3_CTS/TIM1_CH1N) ; also sheet 2
LS2: U$2.27(PB14/SPI2_MISO/USART3_RTS/TIM1_CH2N) ; also sheet 2
LS3: U$2.28(PB15/SPI2_MOSI/TIM1_CH3N) ; also sheet 2
LSIG1: U$2.10(PA0_WKUP/USART2_CTS/ADC12_IN0/TIM2_CH1_ETR) ; also sheet 2
LSIG2: U$2.11(PA1/USART2_RTS/ADC12_IN1/TIM2_CH2) ; also sheet 2
LSIG3: U$2.12(PA2/USART2_TX/ADC12_IN2/TIM2_CH3) ; also sheet 2
MISO: MOUSE.7 U$2.40(PB4/NJTRST)
MOSI: MOUSE.8 U$2.41(PB5/I2C1_SMBA)
MOT: MOUSE.4 U$2.43(PB7/I2C1_SDA/TIM4_CH2)
N$70: R2.2 RST.P$1
N$72: BOOT.P$1 R3.1
N$73: R5.2 U$2.19(PB1/ADC12_IN9/TIM3_CH4)
N$74: D1.A R5.1
NRESET: MOUSE.3 U$2.42(PB6/I2C1_SCL/TIM4_CH1)
OSC_IN: C6.2 U$2.5(PD0-OSC_IN) Y1.P$2
OSC_OUT: C7.2 U$2.6(PD1-OSC_OUT) Y1.P$1
RESET: R1.1 RST.P$2 U$2.7(NRST)
RX1: U$2.31(PA10/USART1_RX/TIM1_CH3) X2.6
RX3: U$2.22(PB11/I2C2_SDA/USART3_RX) U$15.11
SCK: MOUSE.6 U$2.39(PB3/JTDO)
SS: MOUSE.5 U$2.38(PA15/JTDI)
SWCLK: U$2.37(PA14/JTCK/SWCLK) X2.2
SWDIO: U$2.34(PA13/JTMS/SWDIO) X2.3
TX1: U$2.30(PA9/USART1_TX/TIM1_CH2) X2.5
TX3: U$2.21(PB10/I2C2_SCL/USART3_TX) U$15.9
V_BATT: R6.2 ; also sheet 1,3,5
VCCA: C4.2 C5.2 FB1.2 U$2.9(VDD_A) ; supply symbol labelled A3.3V ; also sheet 2
Unconnected: U$2.2(PC13-TAMPER-RTC) U$2.3(PC14-OSC32_IN) U$2.4(PC15-OSC32_OUT) U$2.18(PB0/ADC12_IN8/TIM3_CH3) U$2.20(PB2/BOOT1) U$2.32(PA11/USART1_CTS/CAN_RX/TIM1_CH4/USBDM) U$2.33(PA12/USART1_RTS/CAN_TX/TIM1_ETR/USBDP) U$2.46(PB9/TIM4_CH4)

## Sheet 5 of 5
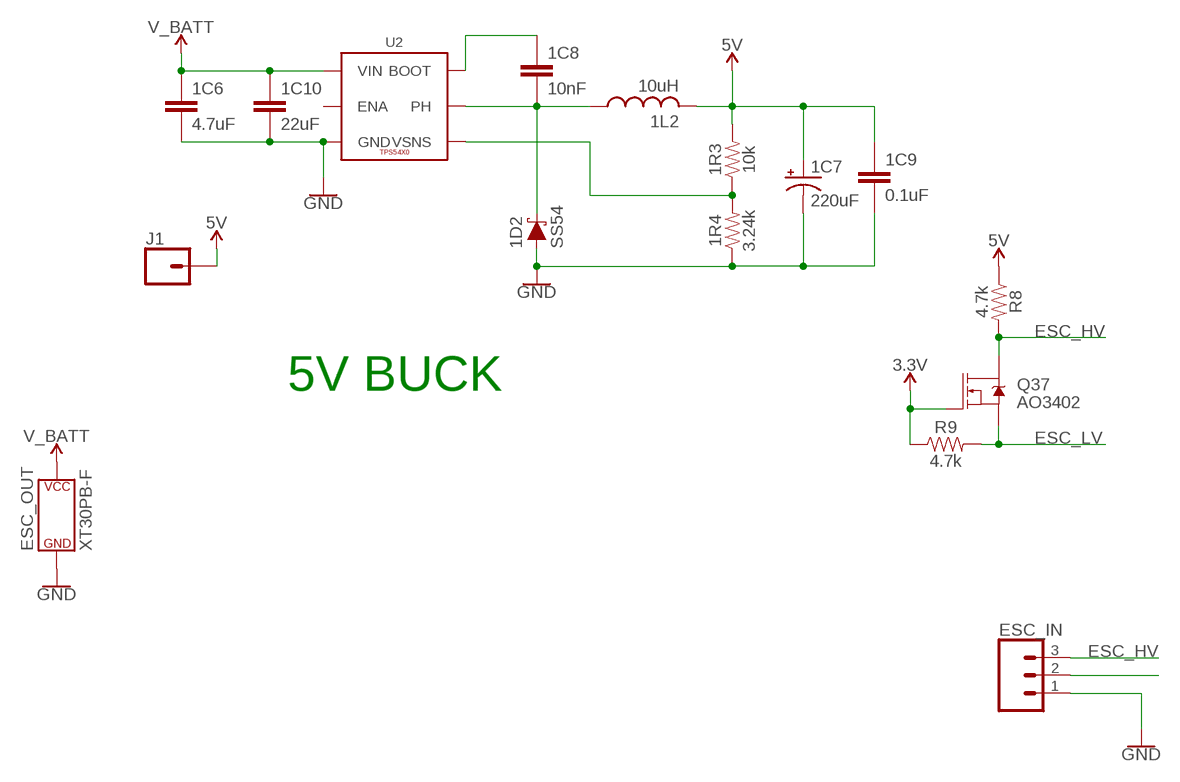
[diagram p4: schematic, sheet 5]

### Parts
1C6  4.7uF  CAPACITOR0603  [C0603]
1C7  220uF  100UF-POLAR-EIA7343-10V-10%(TANT)  [EIA7343]
1C8  10nF  CAPACITOR0603  [C0603]
1C9  0.1uF  CAPACITOR0603  [C0603]
1C10  22uF  CAPACITOR1210  [C1210]
1D2  SS54  DIODE-SCHOTTKY  [SMA-DIODE]
1L2  10uH  INDUCTORSWPA8040  [SWPA8040]
1R3  10k  RESISTOR0603  [R0603]
1R4  3.24k  RESISTOR0603  [R0603]
ESC_IN  CONN_03LOCK  [1X03_LOCK]
ESC_OUT  XT30PB-F  [XT30PB-F]
J1  CONN_01  [1X01]
Q37  AO3402  MOSFET-NCH-AO3404A  [SOT23-3]
R8  4.7k  RESISTOR0603  [R0603]
R9  4.7k  RESISTOR0603  [R0603]
U2  TPS54X0  [POWERPAD-SOIC-8]

### Nets
3.3V1: Q37.1(G) R9.1 ; supply symbol labelled 3.3V
5V: 1C7.A(+) 1C9.1 1L2.P2 1R3.2 J1.1 R8.1
ESC_HV: ESC_IN.3 Q37.3(D) R8.2
ESC_LV: Q37.2(S) R9.2
GND: 1C6.2 1C7.C(-) 1C9.2 1C10.2 1D2.A 1R4.1 ESC_IN.1 ESC_OUT.-(P$V-) U2.6(GND) U2.9(GND) U2.P$1(GND) U2.P$2(GND) U2.P$3(GND) U2.P$4(GND) U2.P$5(GND) U2.P$6(GND) ; also sheet 1,2,3,4
N$3: 1C8.2 1D2.C 1L2.P1 U2.8(PH)
N$5: 1R3.1 1R4.2 U2.4(VSNS)
N$6: 1C8.1 U2.1(BOOT)
N$7: ESC_IN.2
V_BATT: 1C6.1 1C10.1 ESC_OUT.+(P$V+) U2.7(VIN) ; also sheet 1,3,4
Unconnected: U2.2(NC) U2.3(NC) U2.5(ENA)

### Notes on the sheet
- 5V BUCK

## Library data of the parts
1C1-1C3 1C5 1C6 1C8-1C10 2C1-2C6 3C1 3C2 C1-C8 LC1-LC6 M1C1 M1C3 M2C1 M2C3 M3C1 M3C3 M4C1 M4C3 = JH:CAPACITOR
1C4 1C7 = SparkFun-Capacitors:100UF-POLAR: 100µF polarized capacitors A capacitor is a passive two-terminal electrical component used to store electrical energy temporarily in an electric field.; PROD_ID: CAP-07890; VALUE: 100uF
1D1 1D2 = JH:DIODE-SCHOTTKY
1L1 1L2 = JH:INDUCTOR
1R1-1R4 2R1-2R6 LG_R2 LR1 M1R1-M1R12 M2R1-M2R12 M3R1-M3R12 M4R1-M4R12 R1-R9 = JH:RESISTOR
BOOT RST = MY-LIBRARY:MOMENTARY_SWITCH_4X3
D1 = SparkFun-LED:LED: LED (Generic) Standard schematic elements and footprints for 5mm, 3mm, 1206, and 0603 sized LEDs. Generic LEDs with no color specified.
ESC_IN = SparkFun-Connectors:CONN_03: Multi connection point. Often used as Generic Header-pin footprint for 0.1 inch spaced/style header connections On any of the 0.1 inch spaced packages, you can populate with these: Break Away Headers - Straight (PRT-00116) Break Away Male Headers - Right Angle (PRT-00553) Female Headers (PRT-00115) Break Away Headers - Machine Pin (PRT-00117) Break Away Female Headers - Swiss Machine Pin (PRT-00743) Stackable Header - 3 Pin (Female, 0.1") (PRT-13875) For SCREWTERMINALS and SPRING TERMINALS visit here: Screw Terimnals on SparkFun.com (5mm/3.5mm/2.54mm spacing) This device is also useful as a general connection point to wire up your design to another part of your project. Our various solder wires solder well into these plated through hole pads. Hook-Up Wire - Assortment (Stranded, 22 AWG) (PRT-11375) Hook-Up Wire - Assortment (Solid Core, 22 AWG) (PRT-11367) View the entire wire category on our website here Special notes: Molex polarized connector foot print use with SKU : PRT-08232 with associated crimp pins and housings.
ESC_OUT M1J1 M2J1 M3J1 M4J1 = JH:XT30
FB1 FB2 = SparkFun-Coils:FERRITE_BEAD: Ferrite Bead (blocks, cores, rings, chokes, etc.) Inductor with layers of ferrite used to suppress high frequencies. Often used to isolate high frequency noise. SparkFun Products: IOIO-OTG - V2.2 SparkFun SAMD21 Mini Breakout SparkFun 6 Degrees of Freedom Breakout - LSM6DS3 SparkFun SAMD21 Dev Breakout; PROD_ID: NDUC-13805
GND_M2A GND_M2B GND_M4A GND_M4B V_BATT_M1A V_BATT_M1B V_BATT_M2A V_BATT_M2B V_BATT_M3A V_BATT_M3B V_BATT_M4A V_BATT_M4B = JH:18AWG
J1 = Connectors:CONN_01: Single connection point. Often used as Generic Header-pin footprint for 0.1 inch spaced/style header connections On any of the 0.1 inch spaced packages, you can populate with these: Break Away Headers - Straight (PRT-00116) Break Away Male Headers - Right Angle (PRT-00553) Female Headers (PRT-00115) Break Away Headers - Machine Pin (PRT-00117) Break Away Female Headers - Swiss Machine Pin (PRT-00743) This device is also useful as a general connection point to wire up your design to another part of your project. Our various solder wires solder well into these plated through hole pads. Hook-Up Wire - Assortment (Stranded, 22 AWG) (PRT-11375) Hook-Up Wire - Assortment (Solid Core, 22 AWG) (PRT-11367) View the entire wire category on our website here Special notes: SMTSO-256-ET is a "flush mount" nut for a 4-40 screw. We mostly use this on specialty testbeds; it is a nice way to connect hardware to your PCB at an adjustable hieght. Also note, the SNAP packages are for using a snappable style connector. We sell a baggie of snaps and they are also used on two LilyPad designs: Snap Assortment - 30 pack (male and female) (DEV-11347) LilyPad Arduino SimpleSnap (DEV-10941) LilyPad SimpleSnap Protoboard (DEV-10940)
LD1-LD36 = JH:3528LED
LDR = SparkFun-Connectors:CONN_02: Multi connection point. Often used as Generic Header-pin footprint for 0.1 inch spaced/style header connections On any of the 0.1 inch spaced packages, you can populate with these: Break Away Headers - Straight (PRT-00116) Break Away Male Headers - Right Angle (PRT-00553) Female Headers (PRT-00115) Break Away Headers - Machine Pin (PRT-00117) Break Away Female Headers - Swiss Machine Pin (PRT-00743) For SCREWTERMINALS and SPRING TERMINALS visit here: Screw Terimnals on SparkFun.com (5mm/3.5mm/2.54mm spacing) This device is also useful as a general connection point to wire up your design to another part of your project. Our various solder wires solder well into these plated through hole pads. Hook-Up Wire - Assortment (Stranded, 22 AWG) (PRT-11375) Hook-Up Wire - Assortment (Solid Core, 22 AWG) (PRT-11367) View the entire wire category on our website here Special notes: Molex polarized connector foot print use with: PRT-08233 with associated crimp pins and housings. 2.54_SCREWTERM for use with PRT-10571. 3.5mm Screw Terminal footprints for PRT-08084 5mm Screw Terminal footprints for use with PRT-08432
LED = SparkFun-Connectors:CONN_02: Multi connection point. Often used as Generic Header-pin footprint for 0.1 inch spaced/style header connections On any of the 0.1 inch spaced packages, you can populate with these: Break Away Headers - Straight (PRT-00116) Break Away Male Headers - Right Angle (PRT-00553) Female Headers (PRT-00115) Break Away Headers - Machine Pin (PRT-00117) Break Away Female Headers - Swiss Machine Pin (PRT-00743) For SCREWTERMINALS and SPRING TERMINALS visit here: Screw Terimnals on SparkFun.com (5mm/3.5mm/2.54mm spacing) This device is also useful as a general connection point to wire up your design to another part of your project. Our various solder wires solder well into these plated through hole pads. Hook-Up Wire - Assortment (Stranded, 22 AWG) (PRT-11375) Hook-Up Wire - Assortment (Solid Core, 22 AWG) (PRT-11367) View the entire wire category on our website here Special notes: Molex polarized connector foot print use with: PRT-08233 with associated crimp pins and housings. 2.54_SCREWTERM for use with PRT-10571. 3.5mm Screw Terminal footprints for PRT-08084 5mm Screw Terminal footprints for use with PRT-08432; SF_ID: PRT-09918
LS1 S3 = SparkFun-Switches:SWITCH-SPDT: Single Pole, Double Throw (SPDT) Switch Single-pole, double-throw (SPDT) switch. Variant Overview SMD-AYZ0202 Surface Mount DPDT Switch (COM-00597) Used on e.g. LilyPad Arduino USB - ATmega32U4 Board PTH-11.6X4.0MM SPDT Mini Power Switch (COM-00102) Used on e.g. SparkFun Simon Says - Through-Hole Soldering Kit (KIT-10547) PTH-11.6X4.0MM-KIT KIT version of SPDT Mini Power Switch - Simplifies soldering by removing tStop of switch pins - only one side can be soldered. PTH-11.6X4.0MM-LOCK LOCK version of SPDT Mini Power Switch - Offset pins hold switch in place for easier soldering. SMD-RIGHT-ANGLE Surface Mount Right Angle Switch (COM-10860) Used on e.g. SparkFun ESP8266 Thing; PROD_ID: SWCH-08261; SF_SKU: COM-00102
M1C2 M2C2 M3C2 M4C2 = MY-LIBRARY:3.5MM_CAP
M1D1 M2D1 M3D1 M4D1 = SparkFun-LED:LED-RED: Red SMD LED Used in manufacturing of most products at SparkFun Packages: 0603 - SMD 0603 package [Product Link] <http://docs.avagotech.com/docs/AV02-0551EN> 0603 SMART - SMD 0603 SMART package ( more efficient and expensive)[Product Link] <http://www.osram-os.com/Graphics/XPic2/00077099_0.pdf> 1206 - SMD1206 package [Product Link] <https://www.sparkfun.com/datasheets/DevTools/LilyPad/Q150OVS4.pdff> SparkFun Products: Pro Mini 328 -5V <https://www.sparkfun.com/products/821> RedBoard <https://www.sparkfun.com/products/12757> IOIO-OTG <https://www.sparkfun.com/products/13613>; PROD_ID: DIO-00819
M1D2 M2D2 M3D2 M4D2 = SparkFun-LED:LED-BLUE: Blue SMD LED Used in manufacturing of various products at SparkFun Packages: 0603 - SMD 0603 package [Product Link] <http://www.digikey.com/product-detail/en/SMLE12BC7TT86/511-1589-2-ND/1641808> 1206 - SMD1206 package [Product Link] <http://www.digikey.com/product-detail/en/lite-on-inc/LTST-C150TBKT/160-1643-1-ND/573584> SparkFun Products: ESP8266 Thing-Dev Board <https://www.sparkfun.com/products/13711> RedBoard <https://www.sparkfun.com/products/12757>; PROD_ID: DIO-08575
M1Q1 M2Q1 M3Q1 M4Q1 = SparkFun-DiscreteSemi:MOSFET-NCH: N-channel MOSFETs Voltage controlled devices that allow control of high current outputs. SparkFun Products: SparkFun OpenScale <https://www.sparkfun.com/products/13261> SparkFun Digital Sandbox <https://www.sparkfun.com/products/12651> SparkFun Monster Moto Shield <https://www.sparkfun.com/products/10182> SparkFun MOSFET Power Controller <https://www.sparkfun.com/products/11214>; PROD_ID: TRANS-09984; VALUE: 35A/25V/8.5mΩ
M_BL M_BR M_FL M_FR = JH:VNH5019
MOUSE = SparkFun-Connectors:CONN_08: Multi connection point. Often used as Generic Header-pin footprint for 0.1 inch spaced/style header connections On any of the 0.1 inch spaced packages, you can populate with these: Break Away Headers - Straight (PRT-00116) Break Away Male Headers - Right Angle (PRT-00553) Female Headers (PRT-00115) Break Away Headers - Machine Pin (PRT-00117) Break Away Female Headers - Swiss Machine Pin (PRT-00743) Arduino Stackable Header - 8 Pin (PRT-09279) For SCREWTERMINALS and SPRING TERMINALS visit here: Screw Terimnals on SparkFun.com (5mm/3.5mm/2.54mm spacing) This device is also useful as a general connection point to wire up your design to another part of your project. Our various solder wires solder well into these plated through hole pads. Hook-Up Wire - Assortment (Stranded, 22 AWG) (PRT-11375) Hook-Up Wire - Assortment (Solid Core, 22 AWG) (PRT-11367) View the entire wire category on our website here Special notes: Molex polarized connector foot print use with SKU : PRT-08231 with associated crimp pins and housings. 1MM SMD Version SKU: PRT-10208 NOTES ON THE VARIANTS LOCK and LOCK_LONGPADS... This footprint was designed to help hold the alignment of a through-hole component (i.e. 6-pin header) while soldering it into place. You may notice that each hole has been shifted either up or down by 0.005 of an inch from it's more standard position (which is a perfectly straight line). This slight alteration caused the pins (the squares in the middle) to touch the edges of the holes. Because they are alternating, it causes a "brace" to hold the component in place. 0.005 has proven to be the perfect amount of "off-center" position when using our standard breakaway headers. Although looks a little odd when you look at the bare footprint, once you have a header in there, the alteration is very hard to notice. Also,if you push a header all the way into place, it is covered up entirely on the bottom side.
MU1 MU2 = MY-LIBRARY:SN74LVC2G04DBVR
MUX_L1-MUX_L3 = JH:74HC4067
Q1-Q36 = SparkFun-Sensors:LIGHT_SENSOR: Ambient Light Sensors - Phototransistors Low cost ambient light sensors, consisting of a phototransistor in miniature SMD packages. Output voltage varies with light intensity. SparkFun Products ALS-PT19 Light Sensor (SEN-12566) Ambient Light Sensor - TEMT6000 (SEN-08348) SparkFun Ambient Light Sensor Breakout - TEMT60000 (SEN-08688); PROD_ID: IC-11836; SF_ID: SEN-12566
Q37 = SparkFun-DiscreteSemi:MOSFET-NCH: N-channel MOSFETs Voltage controlled devices that allow control of high current outputs. SparkFun Products: SparkFun OpenScale <https://www.sparkfun.com/products/13261> SparkFun Digital Sandbox <https://www.sparkfun.com/products/12651> SparkFun Monster Moto Shield <https://www.sparkfun.com/products/10182> SparkFun MOSFET Power Controller <https://www.sparkfun.com/products/11214>; PROD_ID: TRANS-12988; VALUE: 5.8A/30V/35mΩ
U1 U2 = JH:TPS54X0
U$1 = JH:XT60
U$2 = JH:STM32F103CBT6
U$15 = MY-LIBRARY:CONN_07X2
X2 = con-JST SH:SM06B-SRSS: JST SH series header 1.00mm pitch disconnectable crimp style connectors, horizontal (side entry type), 6 pins
Y1 = SparkFun-Clocks:CRYSTAL: Crystals (Generic) These are passive quartz crystals, which can be used as a clock source for a microcontroller. Crystal's are two-terminal devices. They require external "load" capacitors to generate an oscillating signal.